# EAGLE design reciever (EAGLE 7.3.0)
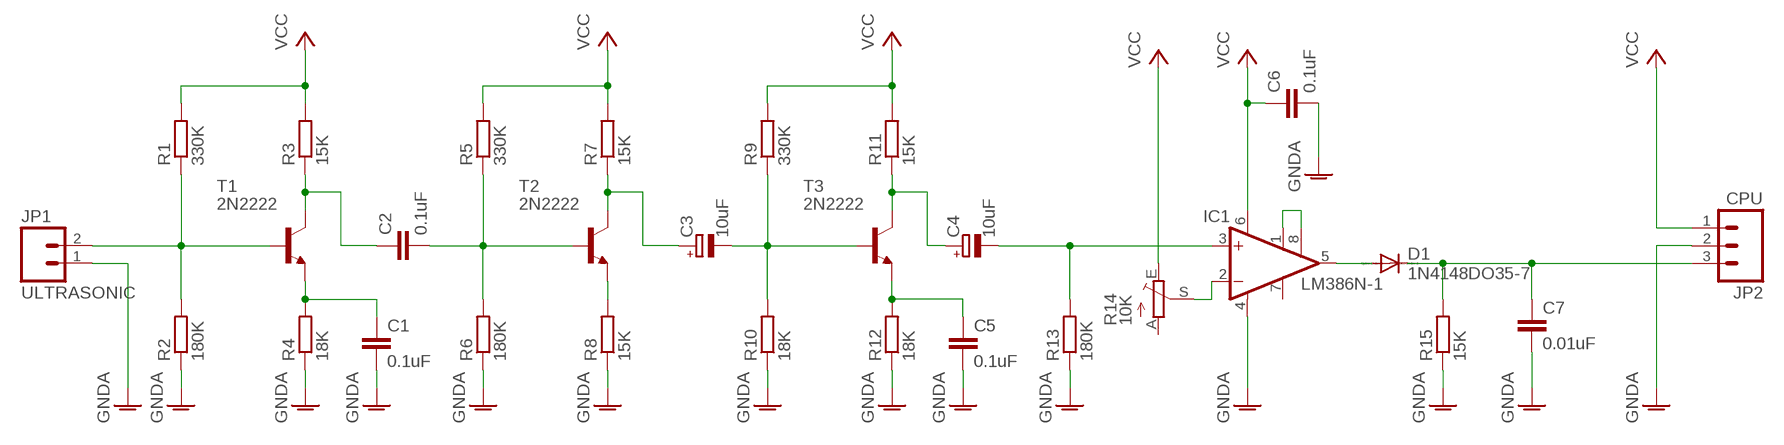
[diagram p0: schematic, sheet 1]

## Parts
C1  0.1uF  C-EU050-025X075  [C050-025X075]
C2  0.1uF  C-EU050-025X075  [C050-025X075]
C3  10uF  CPOL-EUE2.5-5  [E2,5-5]
C4  10uF  CPOL-EUE2.5-5  [E2,5-5]
C5  0.1uF  C-EU050-025X075  [C050-025X075]
C6  0.1uF  C-EU050-025X075  [C050-025X075]
C7  0.01uF  C-EU050-025X075  [C050-025X075]
D1  1N4148DO35-7  [DO35-7]
IC1  LM386N-1  [DIL08]
JP1  ULTRASONIC  M02JST-PTH-VERT  [JST-2-PTH-VERT]
JP2  CPU  M03JST-PTH-VERT  [JST-3-PTH-VERT]
R1  330K  R-EU_0204/7  [0204/7]
R2  180K  R-EU_0204/7  [0204/7]
R3  15K  R-EU_0204/7  [0204/7]
R4  18K  R-EU_0204/7  [0204/7]
R5  330K  R-EU_0204/7  [0204/7]
R6  180K  R-EU_0204/7  [0204/7]
R7  15K  R-EU_0204/7  [0204/7]
R8  15K  R-EU_0204/7  [0204/7]
R9  330K  R-EU_0204/7  [0204/7]
R10  18K  R-EU_0204/7  [0204/7]
R11  15K  R-EU_0204/7  [0204/7]
R12  18K  R-EU_0204/7  [0204/7]
R13  180K  R-EU_0204/7  [0204/7]
R14  10K  TRIM_EU-B25P  [B25P]
R15  15K  R-EU_0204/7  [0204/7]
T1  2N2222  -NPN-TO92-EBC  [TO92-EBC]
T2  2N2222  -NPN-TO92-EBC  [TO92-EBC]
T3  2N2222  -NPN-TO92-EBC  [TO92-EBC]

## Nets
GNDA: C1.2 C5.2 C6.2 C7.2 IC1.4(GND) JP1.1 JP2.2 R2.1 R4.1 R6.1 R8.1 R10.1 R12.1 R13.1 R15.1
N$1: JP1.2 R1.1 R2.2 T1.B
N$2: C2.1 R3.1 T1.C
N$3: C1.1 R4.2 T1.E
N$4: R8.2 T2.E
N$5: C2.2 R5.1 R6.2 T2.B
N$6: C7.1 D1.C JP2.3 R15.2
N$7: C3.+ R7.1 T2.C
N$8: C3.- R9.1 R10.2 T3.B
N$9: C5.1 R12.2 T3.E
N$10: IC1.2(-IN) R14.S
N$11: C4.+ R11.1 T3.C
N$14: C4.- IC1.3(+IN) R13.2
N$16: IC1.1(GAIN) IC1.8(GAIN)
N$17: D1.A IC1.5(OUT)
VCC: C6.1 IC1.6(VS) JP2.1 R1.2 R3.2 R5.2 R7.2 R9.2 R11.2 R14.E
Unconnected: IC1.7(BYPASS) R14.A

## Library data of the parts
C1 C2 C5-C7 = resistor:C-EU: CAPACITOR, European symbol
C3 C4 = resistor:CPOL-EU: POLARIZED CAPACITOR, European symbol
D1 = diode:1N4148: DIODE high speed (Philips)
IC1 = linear:LM386?-*: Low Voltage Audio Power Amplifier Source: http://cache.national.com/ds/LM/LM386.pdf
JP1 = SparkFun-Connectors:M02: Standard 2-pin 0.1" header. Use with - straight break away headers ( PRT-00116) - right angle break away headers (PRT-00553) - swiss pins (PRT-00743) - machine pins (PRT-00117) - female headers (PRT-00115) Molex polarized connector foot print use with: PRT-08233 with associated crimp pins and housings. 2.54_SCREWTERM for use with PRT-10571. 3.5mm Screw Terminal footprints for PRT-08084 5mm Screw Terminal footprints for use with PRT-08432
JP2 = SparkFun-Connectors:M03: Header 3 Standard 3-pin 0.1" header. Use with straight break away headers (SKU : PRT-00116), right angle break away headers (PRT-00553), swiss pins (PRT-00743), machine pins (PRT-00117), and female headers (PRT-00115). Molex polarized connector foot print use with SKU : PRT-08232 with associated crimp pins and housings.
R1-R13 R15 = resistor:R-EU_: RESISTOR, European symbol
R14 = pot:TRIM_EU-: POTENTIOMETER
T1-T3 = transistor:*-NPN-: NPN Transistror BF959 corrected 2008.03.06

## Board
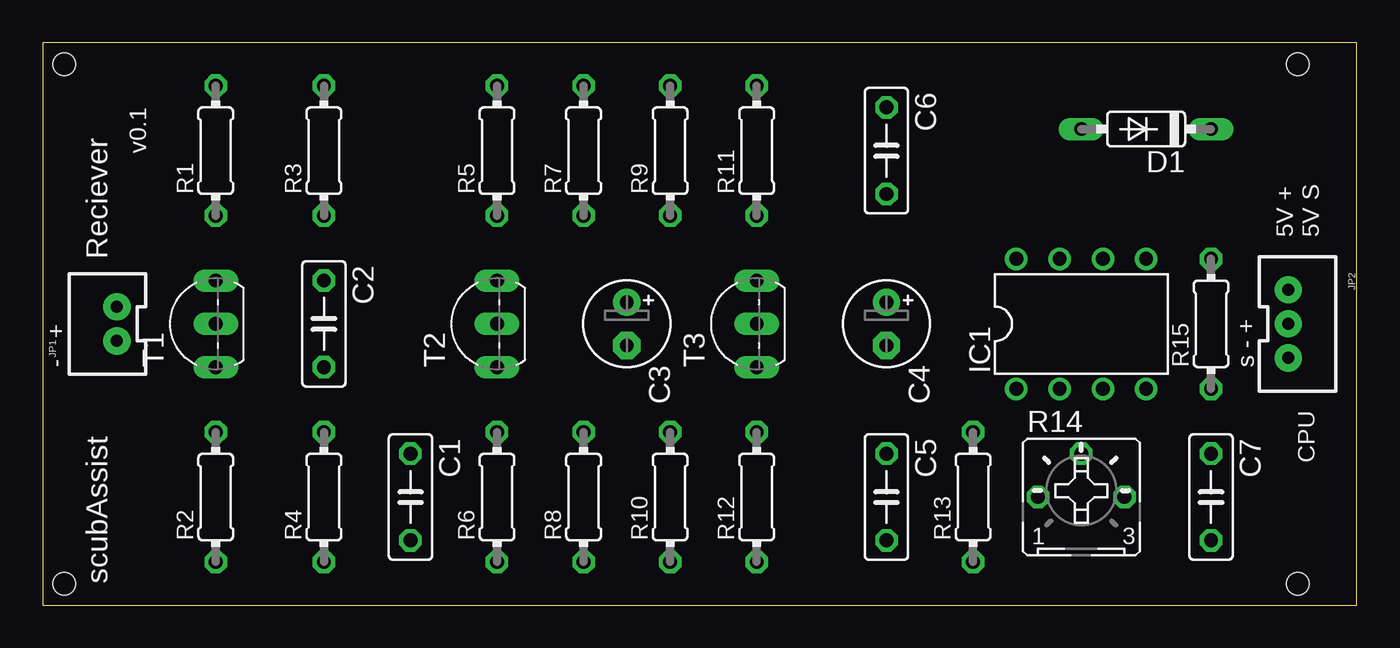
[diagram p1: board, top side]
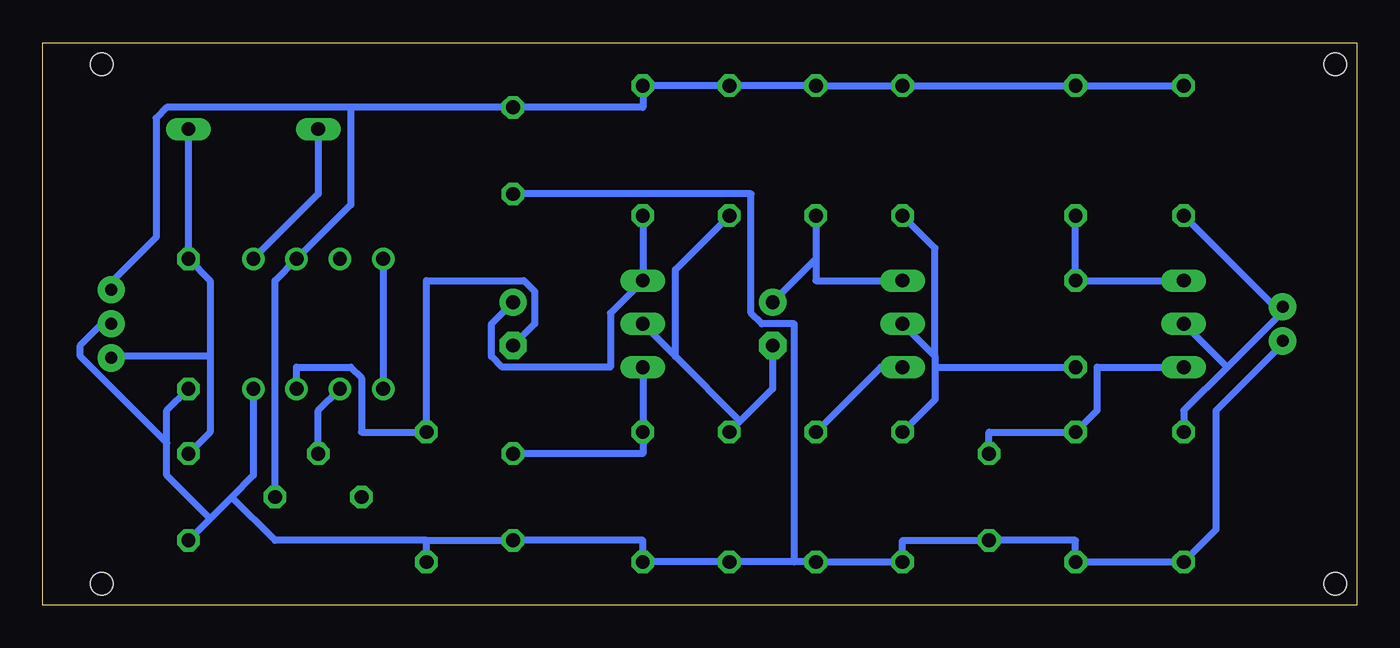
[diagram p2: board, bottom side, seen from below]

Size 77.14 x 33.01 mm. Coordinates in mm from the lower left corner, seen from the top.
Outline: 0,0 77.14,0 77.14,33.01 0,33.01 0,0
Copper layers (1*16): Top 0.035mm / dielectric 1.5mm / Bottom 0.035mm
Design rules "default *": minimum track width 16mil, minimum drill 24mil, track to track 8mil, track to pad 8mil, pad to pad 8mil, via to via 8mil, smd to smd 8mil, copper to edge 40mil, drill to drill 8mil, minimum pad ring 10mil, minimum via ring 8mil, stop-mask expansion 4mil, vias tented up to drill 0mil, thermal gap 10mil
Holes 1.3 mm at 1.27,31.75 1.27,1.27 73.66,1.27 73.66,31.75

### Footprints (pad centres in the part's own frame; a part is rotated, then mirrored left to right if it is on the bottom)
C050-025X075 = drill 0.813 octagon: 1 -2.54,0; 2 2.54,0
E2,5-5 = drill 0.813 pad 1.6: + -1.27,0 | drill 0.813 pad 1.6 octagon: - 1.27,0
DO35-7 = drill 0.813 long: A 3.81,0; C -3.81,0
DIL08 = drill 0.813 pad 1.27: 1 -3.81,-3.81; 2 -1.27,-3.81; 3 1.27,-3.81; 4 3.81,-3.81; 5 3.81,3.81; 6 1.27,3.81; 7 -1.27,3.81; 8 -3.81,3.81
JST-2-PTH-VERT = drill 0.7 pad 1.6: 1 -1,-0.55; 2 1,-0.55
JST-3-PTH-VERT = drill 0.7 pad 1.6: 1 -2,-0.55; 2 0,-0.55; 3 2,-0.55
0204/7 = drill 0.813 octagon: 1 -3.81,0; 2 3.81,0
B25P = drill 0.813 octagon: A -2.54,0; E 2.54,0; S 0,2.54
TO92-EBC = drill 0.813 long: B 0,-1.27; C 2.54,-1.27; E -2.54,-1.27

### Placement (x,y rotation side)
C1  21.59,6.35 270 top
C2  16.51,16.51 270 top
C3  34.29,16.51 270 top
C4  49.53,16.51 270 top
C5  49.53,6.35 270 top
C6  49.53,26.67 270 top
C7  68.58,6.35 270 top
D1  64.77,27.94 180 top
IC1  60.96,16.51 0 top
JP1  3.81,16.51 90 top
JP2  73.66,16.51 270 top
R1  10.16,26.67 90 top
R2  10.16,6.35 90 top
R3  16.51,26.67 90 top
R4  16.51,6.35 90 top
R5  26.67,26.67 90 top
R6  26.67,6.35 90 top
R7  31.75,26.67 90 top
R8  31.75,6.35 90 top
R9  36.83,26.67 90 top
R10  36.83,6.35 90 top
R11  41.91,26.67 90 top
R12  41.91,6.35 90 top
R13  54.61,6.35 90 top
R14  60.96,6.35 0 top
R15  68.58,16.51 90 top
T1  8.89,16.51 90 top
T2  25.4,16.51 90 top
T3  40.64,16.51 90 top

### Tracks (layer width: path | path; a pad name or v marks a point on that pad's centre or on a via)
GNDA
  Bottom 0.406: JP1.1 4.45,15.24 8.26,11.43 8.26,4.45 R2.1 R4.1 16.51,3.81 C1.2 26.67,3.81 R6.1 R8.1 33.02,2.54 | 66.04,6.35 64.77,7.62 IC1.4 | 66.04,6.35 67.31,5.08 | 67.31,5.08 C7.2 | R15.1 69.85,11.43 69.85,9.53 | 69.85,9.53 69.85,7.62 67.31,5.08 | 69.85,9.53 74.93,14.6 74.93,15.24 73.66,16.51 JP2.2 | 54.61,3.81 C5.2 41.91,3.81 R12.1 R10.1 33.02,2.54 | R13.1 54.61,3.81 | C6.2 35.56,24.13 35.56,17.15 34.92,16.51 33.02,16.51 33.02,2.54 | 66.04,6.35 63.5,3.81 54.61,3.81
N$1
  Bottom 0.406: R2.2 10.16,11.43 7.62,13.97 | 4.45,17.15 7.62,13.97 | 7.62,13.97 T1.B | 4.45,17.15 R1.1 | 4.45,17.15 JP1.2
N$2
  Bottom 0.406: T1.C C2.1 R3.1
N$3
  Bottom 0.406: C1.1 21.59,10.16 R4.2 15.24,11.43 15.24,13.97 T1.E
N$4
  Bottom 0.406: R8.2 27.94,13.97 T2.E
N$5
  Bottom 0.406: 24.77,13.97 C2.2 | 24.77,14.6 24.77,13.97 | T2.B 24.77,14.6 | R6.2 24.77,12.06 24.77,13.97 | R5.1 24.77,20.95 24.77,14.6
N$6
  Bottom 0.406: C7.1 67.31,10.16 67.31,14.6 | 67.31,14.6 67.31,19.05 R15.2 D1.C | 67.31,14.6 73.03,14.6 JP2.3
N$7
  Bottom 0.406: T2.C 31.75,19.05 31.75,20.32 | R7.1 31.75,20.32 | 31.75,20.32 C3.+
N$8
  Bottom 0.406: 36.2,10.79 34.29,12.7 C3.- | 36.2,10.79 R10.2 | 36.2,10.79 40.01,14.6 | 40.01,14.6 T3.B | R9.1 40.01,19.69 40.01,14.6
N$9
  Bottom 0.406: T3.E R12.2 41.91,8.89 C5.1
N$10
  Bottom 0.406: IC1.2 60.96,11.43 R14.S
N$11
  Bottom 0.406: R11.1 T3.C 43.81,17.15 43.81,13.97 50.16,13.97 50.8,14.6 50.8,16.51 C4.+
N$14
  Bottom 0.406: IC1.3 62.23,13.97 59.05,13.97 58.42,13.33 58.42,10.16 R13.2 54.61,19.05 48.9,19.05 48.26,18.41 48.26,16.51 C4.-
N$16
  Bottom 0.406: IC1.8 IC1.1
N$17
  Bottom 0.406: IC1.5 60.96,24.13 D1.A
VCC
  Bottom 0.406: R14.E 63.5,19.05 IC1.6 59.05,23.49 59.05,29.21 | R1.2 R3.2 R5.2 R7.2 R9.2 R11.2 41.91,29.21 C6.1 59.05,29.21 | 59.05,29.21 69.85,29.21 70.48,28.57 70.48,21.59 73.03,19.05 JP2.1

### Text on the board
tPlace: v0.1 | 5V + / 5V S | Reciever | - + | s - + | CPU | scubAssist